# EAGLE design hello3 (EAGLE 4.16)
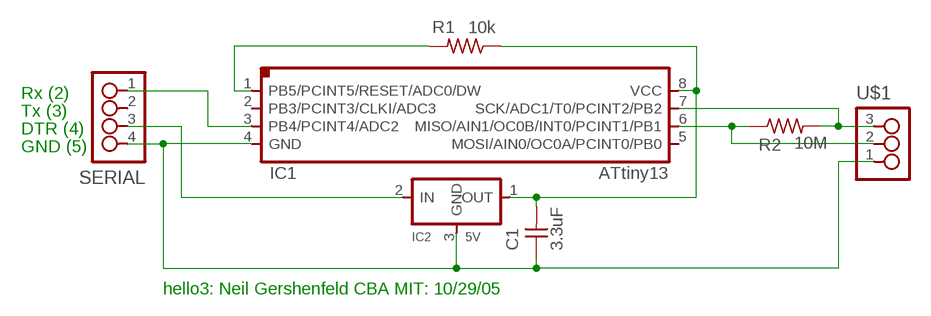
[diagram p0: schematic, sheet 1]

## Parts
C1  3.3uF  UNPOLARIZED_CAPACITOR1206  [1206]
IC1  ATTINY13SI  [SOIC8]
IC2  5V  REGULATORSOT23  [SOT23]
R1  10k  RESISTOR1206  [1206]
R2  10M  RESISTOR1206  [1206]
SERIAL  4_PIN_HEADERMICRO  [MICRO_4]
U$1  3_PIN_HEADERHEADER  [SMT_PINS_3]

## Nets
N$1: C1.2 IC1.8(VCC) IC2.1(OUT) R1.1
N$2: IC1.3(PB4/PCINT4/ADC2) SERIAL.1
N$3: IC2.2(IN) SERIAL.3
N$4: IC1.1(PB5/PCINT5/RESET/ADC0/DW) R1.2
N$6: C1.1 IC1.4(GND) IC2.3(GND) SERIAL.4 U$1.1
N$8: IC1.6(MISO/AIN1/OC0B/INT0/PCINT1/PB1) R2.1 U$1.2
N$11: IC1.7(SCK/ADC1/T0/PCINT2/PB2) R2.2 U$1.3
Unconnected: IC1.2(PB3/PCINT3/CLKI/ADC3) IC1.5(MOSI/AIN0/OC0A/PCINT0/PB0) SERIAL.2

## Notes on the sheet
- Rx (2)
- Tx (3)
- DTR (4)
- GND (5)
- hello3: Neil Gershenfeld CBA MIT: 10/29/05

## Library data of the parts
C1 = ng:UNPOLARIZED_CAPACITOR: unpolarized_capacitor
IC1 = ng:ATTINY13
IC2 = ng:REGULATOR
R1 R2 = ng:RESISTOR
SERIAL = ng:4_PIN_HEADER: 4 SMT pin pads
U$1 = ng:3_PIN_HEADER: 3 SMT pin pads

## Board
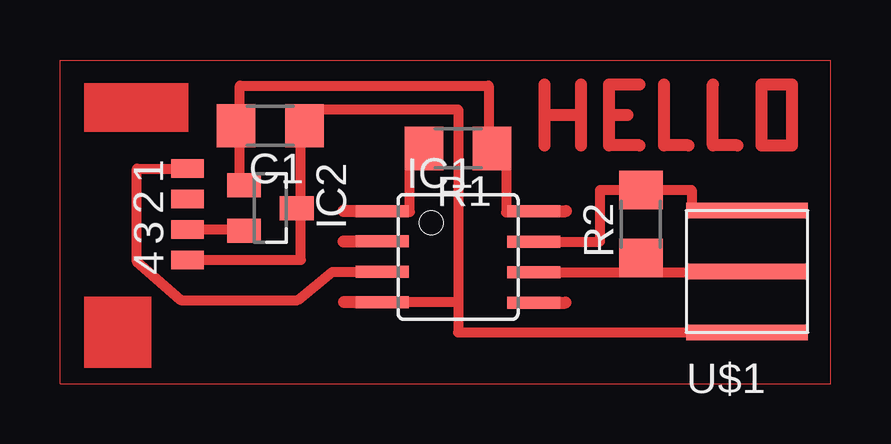
[diagram p1: board, top side]

No outline drawn. Coordinates in mm, seen from the top.
Copper layers (1*16): Top 0.035mm / dielectric 1.5mm / Bottom 0.035mm
Design rules "default": minimum track width 10mil, minimum drill 24mil, track to track 8mil, track to pad 8mil, pad to pad 8mil, via to via 8mil, smd to smd 8mil, copper to edge 40mil, drill to drill 8mil, minimum pad ring 10mil, minimum via ring 8mil, stop-mask expansion 4mil, vias tented up to drill 0mil, thermal gap 10mil

### Footprints (pad centres in the part's own frame; a part is rotated, then mirrored left to right if it is on the bottom)
1206 = smd 1.6 x 1.803: 1 -1.422,0; 2 1.422,0
SOIC8 = smd 0.5 x 2.2: 1 -1.905,-3.154; 2 -0.645,-3.154; 3 0.625,-3.154; 4 1.895,-3.154; 5 1.905,3.154; 6 0.635,3.154; 7 -0.635,3.154; 8 -1.905,3.154
SOT23 = smd 1 x 1.4: 1 -0.95,-1.1; 2 0.95,-1.1; 3 0,1.1
MICRO_4 = smd 0.787 x 1.346: 1 -1.905,1.626; 2 -0.635,1.626; 3 0.635,1.626; 4 1.905,1.626
SMT_PINS_3 = smd 5.08 x 0.635: 1 0,0; 2 0,2.54; 3 0,5.08

### Placement (x,y rotation side)
C1  8.76,10.74 180 top
IC1  16.59,5.28 270 top
IC2  8.76,7.32 270 top
R1  16.59,9.8 180 top
R2  24.21,6.65 90 top
SERIAL  3.68,7.06 270 top
U$1  28.63,2.13 0 top

### Tracks (layer width: path | path; a pad name or v marks a point on that pad's centre or on a via)
N$1
  Top 0.406: IC2.1 7.49,8.27 7.49,10.74 | 7.49,10.74 C1.2 | 7.49,10.74 7.49,12.42 17.86,12.42 17.86,9.8 | 17.86,9.8 17.86,9.68 18.59,9.68 18.59,7.14 19.68,7.19 | 17.86,9.8 R1.1 | 19.68,7.19 19.63,7.19 | 19.68,7.19 IC1.8
N$2
  Top 0.406: IC1.3 11.35,4.66 9.91,3.48 5.03,3.48 3.2,5.08 3.2,8.97 5.23,8.97 | 5.23,8.97 SERIAL.1 | 5.23,8.97 5.23,8.94
N$3
  Top 0.406: 7.49,6.37 7.49,6.3 | 7.49,6.37 IC2.2 | SERIAL.3 7.49,6.43 7.49,6.37
N$4
  Top 0.406: IC1.1 14.58,7.16 14.58,9.8 15.06,9.83 15.06,9.8 | 15.06,9.8 15.06,9.75 | 15.06,9.8 R1.2
N$5
  Top 0.508: 12.93,5.92 11.81,5.92
N$6
  Top 0.406: 10.03,7.32 10.03,10.74 C1.1 10.11,10.74 10.13,11.43 16.59,11.43 16.59,3.43 | 10.03,7.32 IC2.3 | SERIAL.4 10.03,5.16 10.03,7.32 | 28.63,2.11 U$1.1 16.59,2.13 16.59,3.43 | IC1.4 16.59,3.39 16.59,3.43
N$7
  Top 0.508: 12.93,3.4 11.84,3.4
N$8
  Top 0.406: U$1.2 28.5,4.67 28.5,4.65 24.21,4.65 | IC1.6 24.21,4.65 | 24.21,4.65 R2.1
N$10
  Top 0.508: 19.94,3.38 21.06,3.38
N$11
  Top 0.406: R2.2 26.31,8.08 26.31,7.21 28.47,7.24 28.47,7.21 U$1.3 | 24.16,8.08 24.16,8.03 | R2.2 24.16,8.08 | 24.16,8.08 | IC1.7 22.5,5.92 22.5,8.08 24.03,8.08 | 24.03,8.08 | 24.03,8.08 R2.2
N$12
  Top 0.508: 12.93,7.19 11.81,7.19
N$13
  Top 0.508: 19.96,7.19 21.08,7.19
N$14
  Top 0: 0,0 32.11,0 32.11,13.49 0,13.49 0,0
N$17
  Top 0.508: 20.19,9.93 20.19,11.2 | 20.19,11.2 20.19,12.47 | 20.19,11.2 21.72,11.2
N$19
  Top 0.508: 21.72,9.93 21.72,12.47
N$20
  Top 0.508: 22.89,11.2 22.89,12.47 24.16,12.47 | 22.89,11.2 22.89,9.93 24.16,9.93 | 22.89,11.2 23.65,11.2
N$21
  Top 0.508: 25.17,12.47 25.17,9.93 26.19,9.93
N$22
  Top 0.508: 27.2,12.47 27.2,9.93 28.22,9.93
N$23
  Top 0.508: 29.23,9.93 30.5,9.93 30.5,12.47 29.23,12.47 29.23,9.93
(copper drawn outside any net)
  shapes: Top area x2